# EAGLE design vfd_controller_cpu (EAGLE 9.6.1)
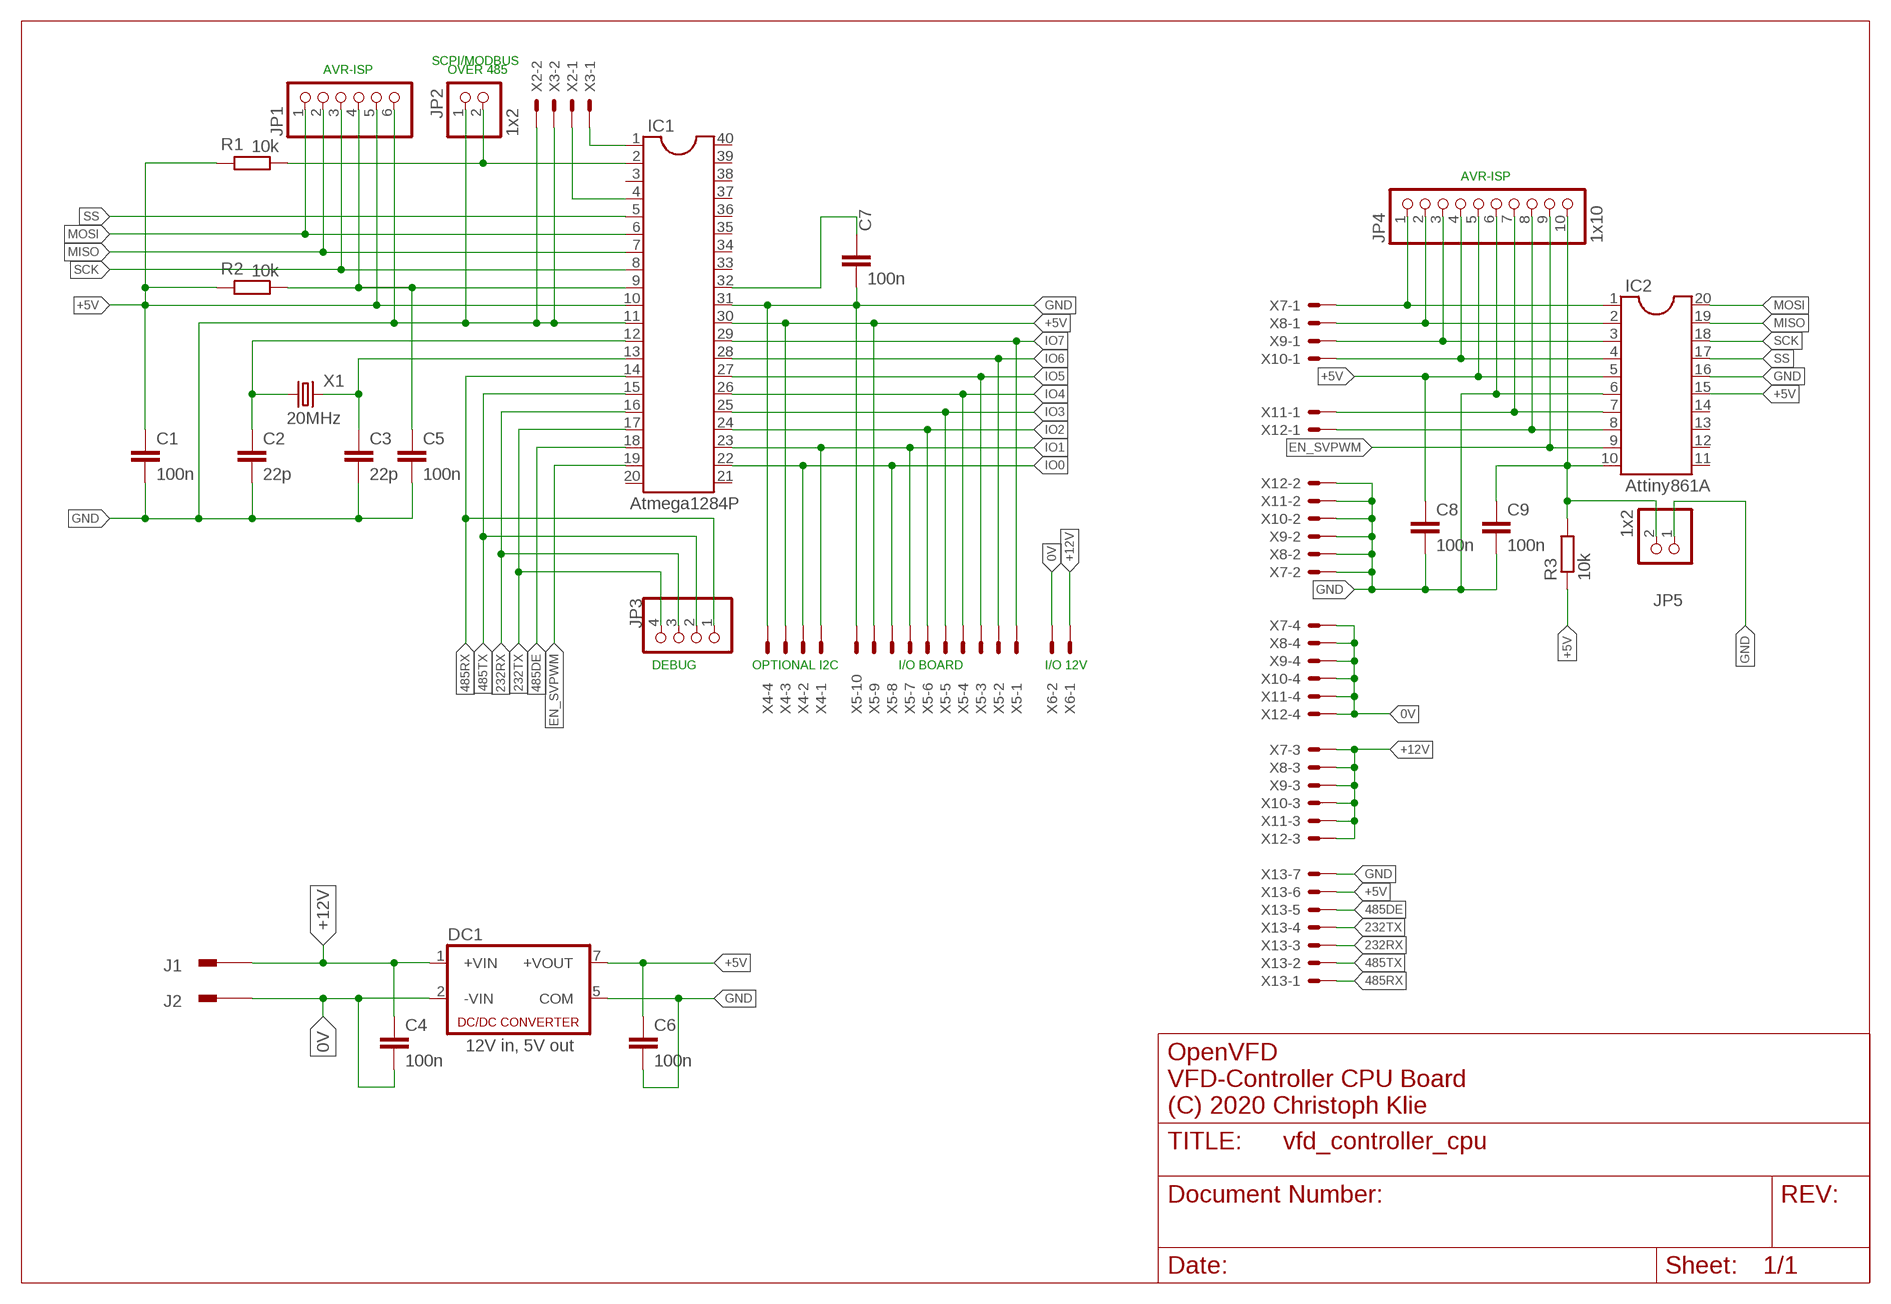
[diagram p0: schematic, sheet 1]

## Parts
C1  100n  C-EU025-024X044  [C025-024X044]
C2  22p  C-EU025-024X044  [C025-024X044]
C3  22p  C-EU025-024X044  [C025-024X044]
C4  100n  C-EU025-024X044  [C025-024X044]
C5  100n  C-EU050-025X075  [C050-025X075]
C6  100n  C-EU050-025X075  [C050-025X075]
C7  100n  C-EU025-024X044  [C025-024X044]
C8  100n  C-EU025-024X044  [C025-024X044]
C9  100n  C-EU025-024X044  [C025-024X044]
DC1  12V in, 5V out  MEV  [MEV]
IC1  Atmega1284P  DIL40  [DIL40]
IC2  Attiny861A  DIL20  [DIL20]
J1  PIN2F061.200  [F061.200]
J2  PIN2F061.200  [F061.200]
JP1  1x6  PINHD-1X6  [1X06]
JP2  1x2  PINHD-1X2  [1X02]
JP3  1x4  PINHD-1X4  [1X04]
JP4  1x10  PINHD-1X10  [1X10]
JP5  1x2  PINHD-1X2  [1X02]
R1  10k  R-EU_0207/12  [0207/12]
R2  10k  R-EU_0204/2V  [0204V]
R3  10k  R-EU_0207/12  [0207/12]
X1  20MHz  CRYSTALS-NOGND-HC49  [HC49]
X2  JST-XH-02-PIN-LONG-PAD  [JST-XH-02-PACKAGE-LONG-PAD]
X3  JST-XH-02-PIN-LONG-PAD  [JST-XH-02-PACKAGE-LONG-PAD]
X4  JST-XH-04-PIN-LONG-PAD  [JST-XH-04-PACKAGE-LONG-PAD]
X5  JST-XH-10-PIN-LONG-PAD  [JST-XH-10-PACKAGE-LONG-PAD]
X6  JST-XH-02-PIN-LONG-PAD  [JST-XH-02-PACKAGE-LONG-PAD]
X7  JST-XH-04-PIN-LONG-PAD  [JST-XH-04-PACKAGE-LONG-PAD]
X8  JST-XH-04-PIN-LONG-PAD  [JST-XH-04-PACKAGE-LONG-PAD]
X9  JST-XH-04-PIN-LONG-PAD  [JST-XH-04-PACKAGE-LONG-PAD]
X10  JST-XH-04-PIN-LONG-PAD  [JST-XH-04-PACKAGE-LONG-PAD]
X11  JST-XH-04-PIN-LONG-PAD  [JST-XH-04-PACKAGE-LONG-PAD]
X12  JST-XH-04-PIN-LONG-PAD  [JST-XH-04-PACKAGE-LONG-PAD]
X13  JST-XH-07-PIN-LONG-PAD  [JST-XH-07-PACKAGE-LONG-PAD]

## Nets
0V: C4.2 DC1.2(-VIN) J2.1A J2.1B X6.2 X7.4 X8.4 X9.4 X10.4 X11.4 X12.4
232RX: IC1.16 JP3.3 X13.3
232TX: IC1.17 JP3.4 X13.4
485DE: IC1.18 X13.5
485RX: IC1.14 JP3.1 X13.1
485TX: IC1.15 JP3.2 X13.2
+5V: C1.1 C6.1 C8.1 DC1.7(+VOUT) IC1.10 IC1.30 IC2.5 IC2.15 JP1.5 JP4.5 R1.2 R2.2 R3.1 X4.3 X5.9 X13.6
+12V: C4.1 DC1.1(+VIN) J1.1A J1.1B X6.1 X7.3 X8.3 X9.3 X10.3 X11.3 X12.3
EN_SVPWM: IC1.19 IC2.9 JP4.9
GND: C1.2 C2.2 C3.2 C5.2 C6.2 C7.2 C8.2 C9.2 DC1.5(COM) IC1.11 IC1.31 IC2.6 IC2.16 JP1.6 JP2.1 JP4.6 JP5.1 X2.2 X3.2 X4.4 X5.10 X7.2 X8.2 X9.2 X10.2 X11.2 X12.2 X13.7
H1: IC2.1 JP4.1 X7.1
H2: IC2.3 JP4.3 X9.1
H3: IC2.7 JP4.7 X11.1
IO0: IC1.22 X4.2 X5.8
IO1: IC1.23 X4.1 X5.7
IO2: IC1.24 X5.6
IO3: IC1.25 X5.5
IO4: IC1.26 X5.4
IO5: IC1.27 X5.3
IO6: IC1.28 X5.2
IO7: IC1.29 X5.1
L1: IC2.2 JP4.2 X8.1
L2: IC2.4 JP4.4 X10.1
L3: IC2.8 JP4.8 X12.1
MISO: IC1.7 IC2.19 JP1.2
MOSI: IC1.6 IC2.20 JP1.1
N$4: IC1.1 X3.1
N$16: C7.1 IC1.32
N$23: IC1.4 X2.1
N$24: IC1.2 JP2.2 R1.1
N$37: C9.1 IC2.10 JP4.10 JP5.2 R3.2
N$41: C5.1 IC1.9 JP1.4 R2.1
N$43: C2.1 IC1.12 X1.1
N$44: C3.1 IC1.13 X1.2
SCK: IC1.8 IC2.18 JP1.3
SS: IC1.5 IC2.17
Unconnected: IC1.3 IC1.20 IC1.21 IC1.33 IC1.34 IC1.35 IC1.36 IC1.37 IC1.38 IC1.39 IC1.40 IC2.11 IC2.12 IC2.13 IC2.14

## Notes on the sheet
- SCPI/MODBUS
- AVR-ISP | OVER 485
- AVR-ISP
- DEBUG | OPTIONAL I2C | I/O BOARD | I/O 12V
- OpenVFD
- VFD-Controller CPU Board
- (C) 2020 Christoph Klie

## Library data of the parts
C1 C4 C7-C9 = rcl:C-EU: CAPACITOR, European symbol; R: MKS02-63 100N; SPICEPREFIX: C
C2 C3 = rcl:C-EU: CAPACITOR, European symbol; R: KERKO 22p; SPICEPREFIX: C
C5 C6 = rcl:C-EU: CAPACITOR, European symbol; R: MKS2-63 100N; SPICEPREFIX: C
DC1 = custom:MEV: DC-DC CONVERTER; R: MEV1S1205SC
IC1 = ic-package:DIL40: Dual In Line; R: ATMEGA 1284-P-PU
IC2 = ic-package:DIL20: Dual In Line / Socket; R: ATTINY 861A-PU
J1 J2 = con-faston:PIN2: Flachstecker Typ Tyco/Electronics/AMP TAB, FASTON Printed Circuit Board Tabs Source: http://www.buerklin.com, http://catalog.tycoelectronics.com; OC_FARNELL: unknown; OC_NEWARK: unknown; R: FS-PW-6,35
JP1 = pinhead:PINHD-1X6: PIN HEADER; R: MPE 087-1-006
JP2 JP5 = pinhead:PINHD-1X2: PIN HEADER; R: MPE 087-1-002
JP3 = pinhead:PINHD-1X4: PIN HEADER; R: MPE 087-1-004
JP4 = pinhead:PINHD-1X10: PIN HEADER; R: MPE 087-1-010
R1-R3 = rcl:R-EU_: RESISTOR, European symbol; R: METALL 10,0K; SPICEPREFIX: R
X1 = IQD-Frequency-Products:CRYSTALS-NOGND: CRYSTALS CAN NOT GROUNDED; R: 20,0000-HC49U-S
X2 X3 X6 =  JST_XH_connnectors:JST-XH-02-PIN: JST XH Connector 2 Pin Wire to board connector. Pitch: 2,54 mm, (0.100") Number of pins: 2 Created by Rembrandt Electronics www.rembrandtelectronics.com; R: JST XH2P ST
X4 X7-X12 =  JST_XH_connnectors:JST-XH-04-PIN: JST XH Connector 2 Pin Wire to board connector. Pitch: 2,54 mm, (0.100") Number of pins: 4 Created by Rembrandt Electronics www.rembrandtelectronics.com; R: JST XH4P ST
X5 =  JST_XH_connnectors:JST-XH-10-PIN: JST XH Connector 2 Pin Wire to board connector. Pitch: 2,54 mm, (0.100") Number of pins: 10 Created by Rembrandt Electronics www.rembrandtelectronics.com; R: JST XH10P ST
X13 =  JST_XH_connnectors:JST-XH-07-PIN: JST XH Connector 2 Pin Wire to board connector. Pitch: 2,54 mm, (0.100") Number of pins: 7 Created by Rembrandt Electronics www.rembrandtelectronics.com; R: JST XH7P ST

## Board
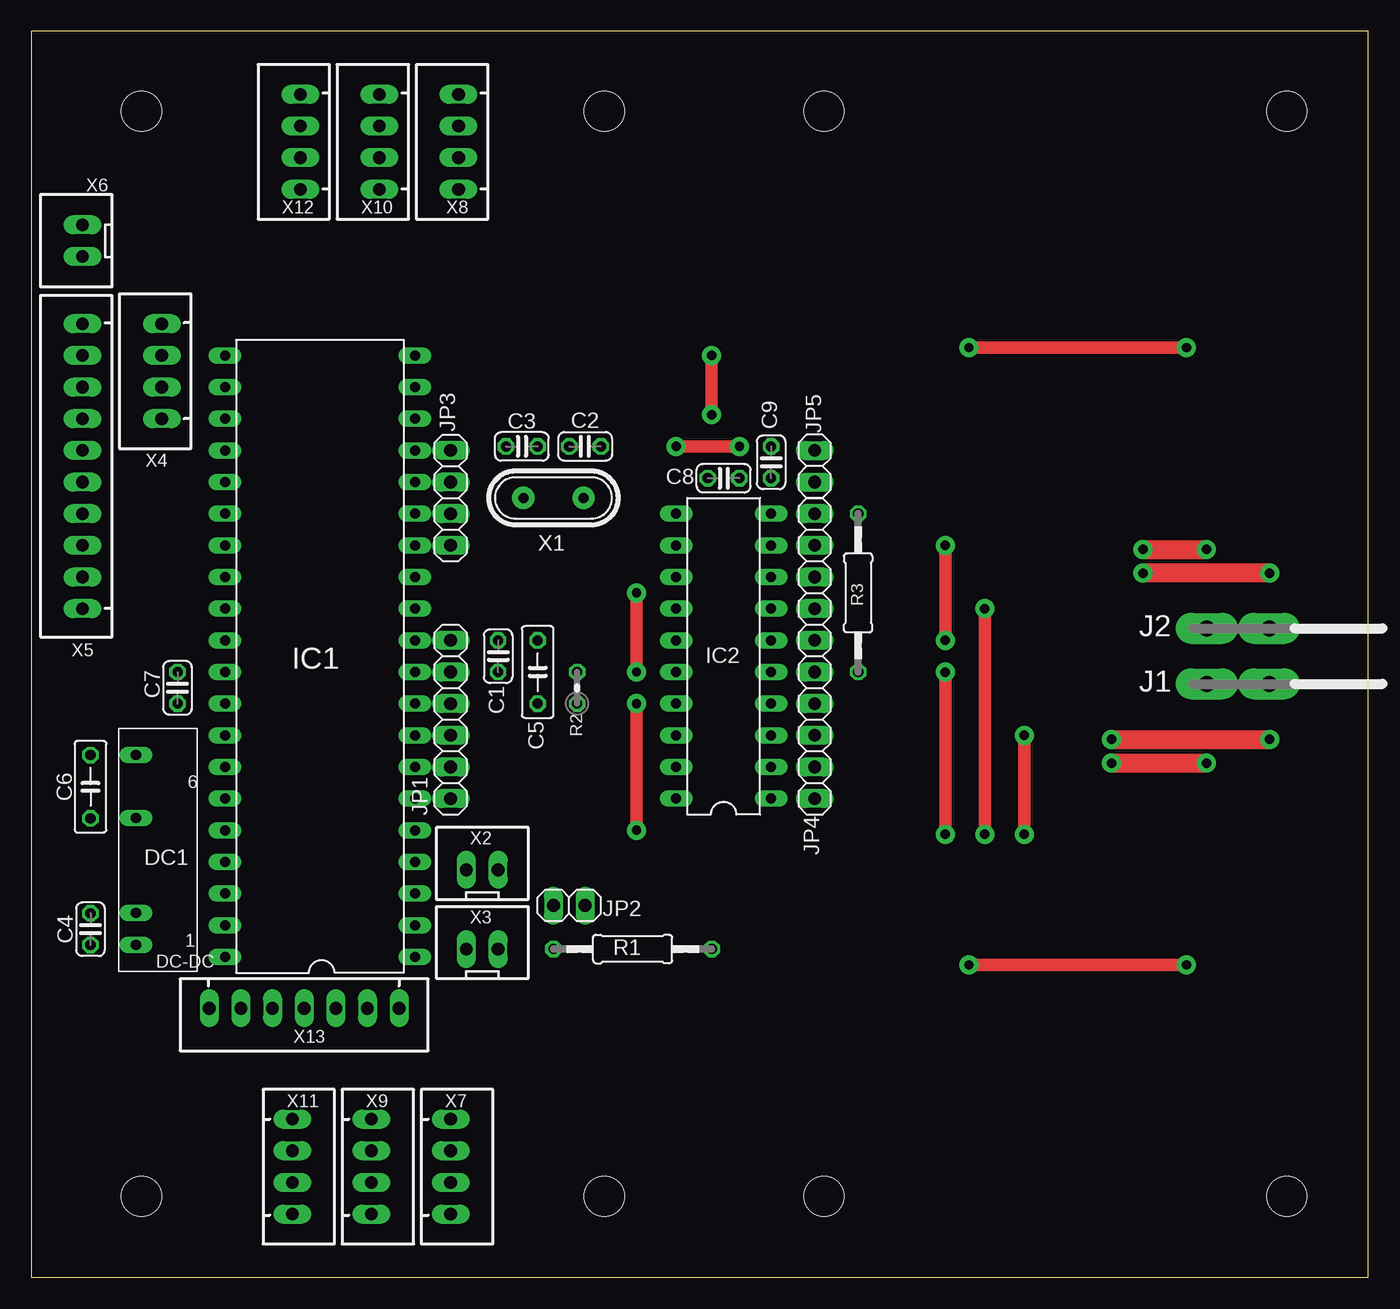
[diagram p1: board, top side]
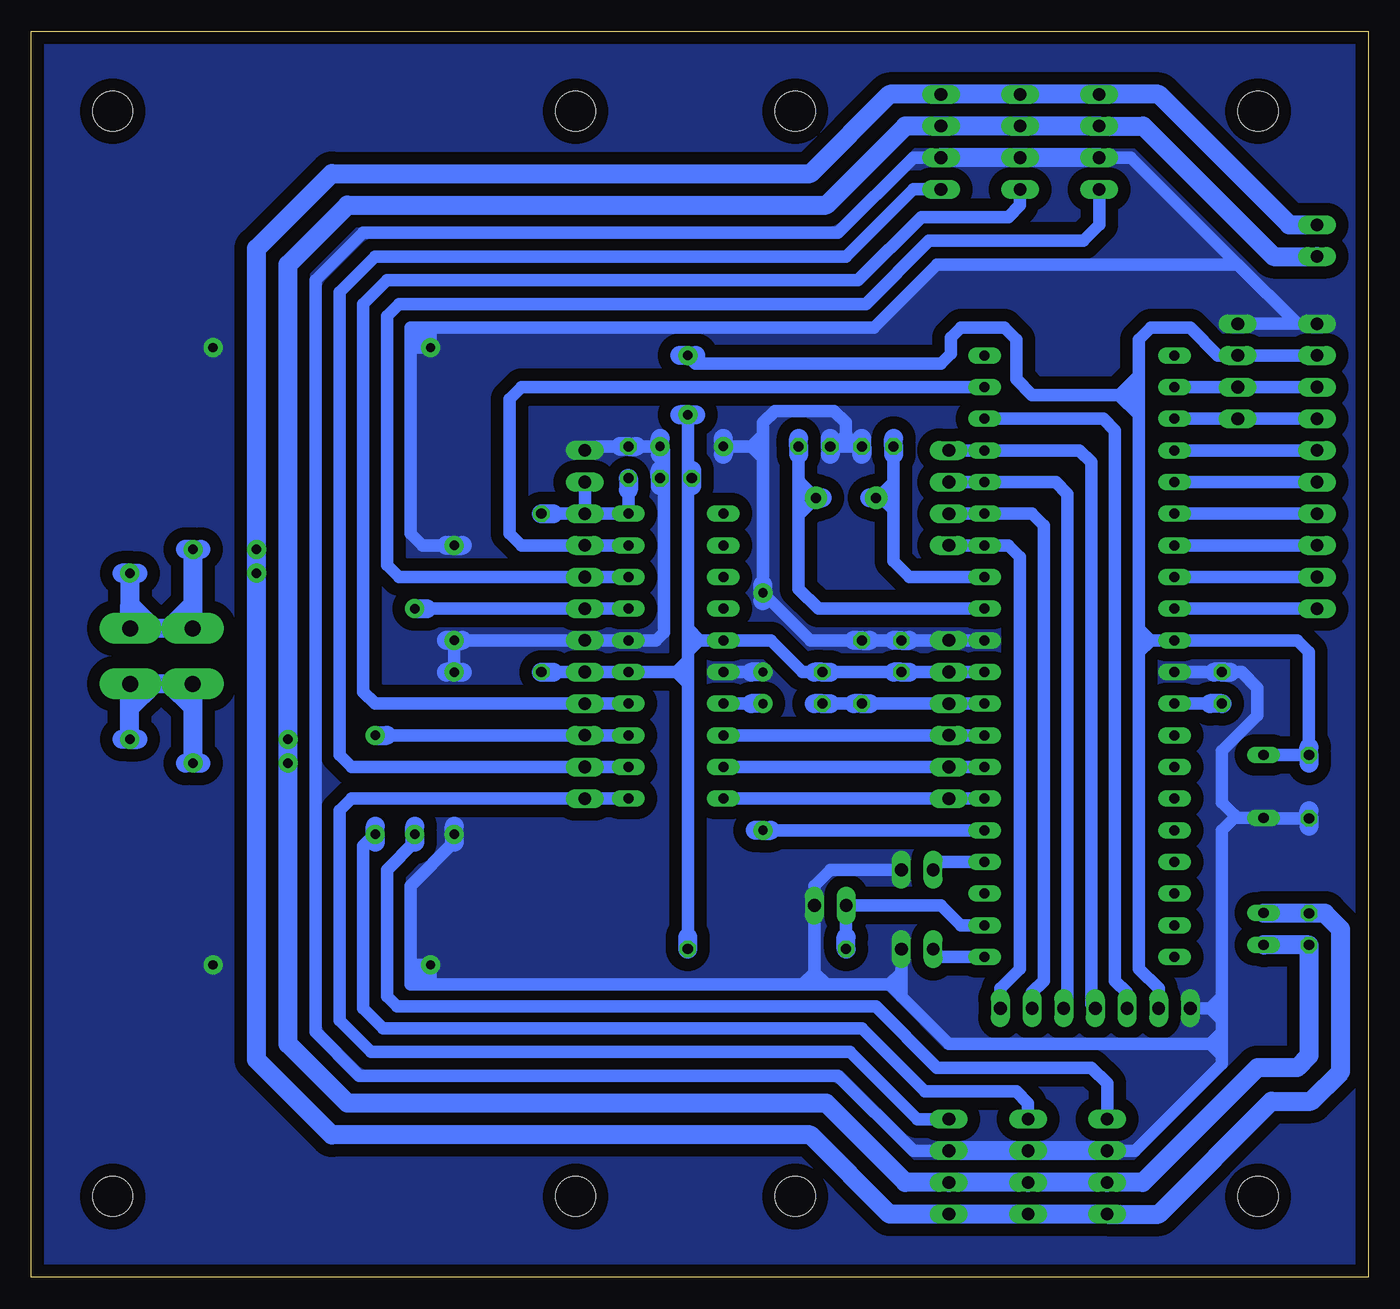
[diagram p2: board, bottom side, seen from below]

Size 107.3 x 100 mm. Coordinates in mm from the lower left corner, seen from the top.
Outline: 0,0 107.3,0 107.3,100 0,100 0,0
Copper layers (1*16): Top 0.035mm / dielectric 1.5mm / Bottom 0.035mm
Design rules "default": minimum track width 6mil, minimum drill 0.35mm, track to track 6mil, track to pad 6mil, pad to pad 6mil, via to via 6mil, smd to smd 6mil, copper to edge 40mil, drill to drill 6mil, minimum pad ring 10mil, minimum via ring 8mil, stop-mask expansion 4mil, vias tented up to drill 0mil, thermal gap 10mil
Holes 3.2 mm at 63.61,93.58 100.76,93.58 63.61,6.5 100.76,6.5 8.85,93.58 45.99,93.58 8.85,6.5 45.99,6.5

### Footprints (pad centres in the part's own frame; a part is rotated, then mirrored left to right if it is on the bottom)
C025-024X044 = drill 0.813 octagon: 1 -1.27,0; 2 1.27,0
C050-025X075 = drill 0.813 octagon: 1 -2.54,0; 2 2.54,0
MEV = drill 0.813 long: 1 -3.683,-6.756; 2 -3.683,-4.216; 5 -3.683,3.404; 7 -3.683,8.484
DIL40 = drill 0.813 long: 1 -24.13,-7.62; 2 -21.59,-7.62; 3 -19.05,-7.62; 4 -16.51,-7.62; 5 -13.97,-7.62; 6 -11.43,-7.62; 7 -8.89,-7.62; 8 -6.35,-7.62; 9 -3.81,-7.62; 10 -1.27,-7.62; 11 1.27,-7.62; 12 3.81,-7.62; 13 6.35,-7.62; 14 8.89,-7.62; 15 11.43,-7.62; 16 13.97,-7.62; 17 16.51,-7.62; 18 19.05,-7.62; 19 21.59,-7.62; 20 24.13,-7.62; 21 24.13,7.62; 22 21.59,7.62; 23 19.05,7.62; 24 16.51,7.62; 25 13.97,7.62; 26 11.43,7.62; 27 8.89,7.62; 28 6.35,7.62; 29 3.81,7.62; 30 1.27,7.62; 31 -1.27,7.62; 32 -3.81,7.62; 33 -6.35,7.62; 34 -8.89,7.62; 35 -11.43,7.62; 36 -13.97,7.62; 37 -16.51,7.62; 38 -19.05,7.62; 39 -21.59,7.62; 40 -24.13,7.62
DIL20 = drill 0.813 long: 1 -11.43,-3.81; 2 -8.89,-3.81; 3 -6.35,-3.81; 4 -3.81,-3.81; 5 -1.27,-3.81; 6 1.27,-3.81; 7 3.81,-3.81; 8 6.35,-3.81; 9 8.89,-3.81; 10 11.43,-3.81; 11 11.43,3.81; 12 8.89,3.81; 13 6.35,3.81; 14 3.81,3.81; 15 1.27,3.81; 16 -1.27,3.81; 17 -3.81,3.81; 18 -6.35,3.81; 19 -8.89,3.81; 20 -11.43,3.81
F061.200 = drill 1.3 pad 2.5 long: 1A -2.5,0; 1B 2.5,0
1X06 = drill 1.016 long: 1 -6.35,0; 2 -3.81,0; 3 -1.27,0; 4 1.27,0; 5 3.81,0; 6 6.35,0
1X02 = drill 1.016 long: 1 -1.27,0; 2 1.27,0
1X04 = drill 1.016 long: 1 -3.81,0; 2 -1.27,0; 3 1.27,0; 4 3.81,0
1X10 = drill 1.016 long: 1 -11.43,0; 2 -8.89,0; 3 -6.35,0; 4 -3.81,0; 5 -1.27,0; 6 1.27,0; 7 3.81,0; 8 6.35,0; 9 8.89,0; 10 11.43,0
0207/12 = drill 0.813 octagon: 1 -6.35,0; 2 6.35,0
0204V = drill 0.813 octagon: 1 -1.27,0; 2 1.27,0
HC49 = drill 0.813 pad 1.8: 1 -2.413,0; 2 2.413,0
JST-XH-02-PACKAGE-LONG-PAD = drill 1.016 long: 1 -1.27,0; 2 1.27,0
JST-XH-04-PACKAGE-LONG-PAD = drill 1.016 long: 1 -3.81,0; 2 -1.27,0; 3 1.27,0; 4 3.81,0
JST-XH-10-PACKAGE-LONG-PAD = drill 1.016 long: 1 -11.43,0; 2 -8.89,0; 3 -6.35,0; 4 -3.81,0; 5 -1.27,0; 6 1.27,0; 7 3.81,0; 8 6.35,0; 9 8.89,0; 10 11.43,0
JST-XH-07-PACKAGE-LONG-PAD = drill 1.016 long: 1 -7.62,0; 2 -5.08,0; 3 -2.54,0; 4 0,0; 5 2.54,0; 6 5.08,0; 7 7.62,0

### Placement (x,y rotation side)
C1  37.46,49.85 90 top
C2  44.45,66.68 180 top
C3  39.37,66.68 0 top
C4  4.76,27.94 90 top
C5  40.64,48.58 90 top
C6  4.76,39.37 270 top
C7  11.75,47.31 90 top
C8  55.56,64.13 0 top
C9  59.37,65.41 90 top
DC1  12.09,33.45 0 top
IC1  23.18,49.85 90 top
IC2  55.56,49.85 90 top
J1  96.84,47.62 0 top
J2  96.84,52.07 0 top
JP1  33.66,44.77 90 top
JP2  43.18,29.85 180 top
JP3  33.66,62.55 90 top
JP4  62.86,49.85 90 top
JP5  62.86,65.09 270 top
R1  48.26,26.35 0 top
R2  43.81,47.31 90 top
R3  66.36,54.93 90 top
U$1  [A4L-LOC]  -78.11,-44.13 0 top  (outside the outline)
X1  41.91,62.55 180 top
X2  36.19,32.7 0 top
X3  36.19,26.35 0 top
X4  10.48,72.71 90 top
X5  4.13,65.09 90 top
X6  4.13,83.19 90 top
X7  33.66,8.89 270 top
X8  34.29,91.12 90 top
X9  27.3,8.89 270 top
X10  27.94,91.12 90 top
X11  20.95,8.89 270 top
X12  21.59,91.12 90 top
X13  21.91,21.59 180 top

### Tracks (layer width: path | path; a pad name or v marks a point on that pad's centre or on a via)
0V  (via drill 0.76 pad 1.52)
  Top 1.524: v89.22,58.42 v94.3,58.42 | v99.38,56.51 v89.22,56.51
  Bottom 1.524: 96.2,52.07 J2.1A 94.34,53.98 | 96.2,52.07 97.47,52.07 | 97.47,52.07 J2.1B 99.38,52.11 99.38,53.98 | DC1.2 8.38,29.21 C4.2 3.49,29.21 2.22,27.94 2.22,16.51 4.6,14.13 7.78,14.13 16.83,5.08 X11.4 X9.4 X7.4 38.42,5.08 44.77,11.43 83.18,11.43 89.22,17.46 v89.22,58.42 89.22,82.55 83.18,88.58 44.77,88.58 38.42,94.93 X8.4 X10.4 X12.4 16.83,94.93 6.35,84.46 X6.2 | v99.38,56.51 99.38,53.98 | v94.3,58.42 94.34,58.38 94.34,53.98 | 94.34,53.98 96.2,52.11 96.2,52.07 | 99.38,53.98 97.47,52.07 | v94.3,58.42 93.66,58.42 | v94.3,58.42 94.93,58.42 | v99.38,56.51 98.74,56.51 | v99.38,56.51 100.01,56.51
232RX
  Bottom 1.016: X13.3 24.13,21.91 24.13,62.87 25.08,63.82 IC1.16 JP3.3
232TX
  Bottom 1.016: X13.4 22.22,21.91 22.22,65.4 23.18,66.36 IC1.17 JP3.4
485DE
  Bottom 1.016: IC1.18 21.27,68.9 20.32,67.95 20.32,23.81 19.37,22.86 X13.5
485RX
  Bottom 1: IC1.14 JP3.1
  Bottom 1.016: IC1.14 28.89,58.74 27.94,57.79 27.94,24.76 29.53,23.18 X13.1
485TX
  Bottom 1.016: X13.2 26.99,22.86 26.03,23.81 26.03,60.32 26.99,61.28 IC1.15 JP3.2
+5V  (via drill 0.76 pad 1.52)
  Top 1.016: v54.61,73.98 v54.61,69.21
  Bottom 1: IC1.10 JP1.5 36.83,48.58 | JP4.5 IC2.5 56.2,48.58 | 54.61,50.16 53.66,51.12 IC2.15 47.94,51.12 45.4,48.58 44.45,48.58 | C1.1 43.18,48.58
  Bottom 1.016: X5.9 X4.3 | X4.3 11.43,73.98 | X4.3 12.06,73.98 14.29,76.2 17.46,76.2 18.41,75.25 18.41,72.39 | C6.1 8.38,41.91 DC1.7 | 17.46,51.12 IC1.30 5.71,51.12 4.76,50.16 4.76,42.54 | 17.46,51.12 18.41,52.07 | 18.41,52.07 18.41,69.21 | 18.41,69.21 18.41,70.8 | 18.41,70.8 18.41,72.39 | 17.46,51.12 18.41,50.16 | 18.41,50.16 18.41,24.76 16.83,23.18 X13.6 | 18.41,52.07 18.41,50.16 | v54.61,73.98 53.98,73.34 34.29,73.34 33.5,74.14 33.5,75.41 32.7,76.2 29.21,76.2 28.26,75.25 28.26,72.07 26.99,70.8 20,70.8 | 54.61,52.07 53.66,51.12 | v54.61,69.21 54.61,64.77 | 54.61,64.77 54.61,63.82 | 54.61,63.82 54.61,52.07 | 54.61,49.53 54.61,50.16 54.61,52.07 | 54.61,49.53 54.61,47.62 | 54.61,47.62 54.61,27.31 | 55.56,48.58 54.61,49.53 | 56.2,48.58 55.56,48.58 | 55.56,48.58 54.61,47.62 | 18.41,69.21 20,70.8 | 20,70.8 18.41,72.39 | 20,70.8 18.41,70.8 | JP4.5 65.4,48.58 | 54.29,64.45 54.61,64.77 | C8.1 54.61,63.82
  Bottom 1.524: 38.1,48.58 C1.1 36.83,48.58 | C8.1 54.29,63.82 | C8.1 54.29,64.45 | C8.1 54.29,64.77 | C8.1 54.29,63.5 | 53.98,69.21 v54.61,69.21 55.24,69.21 | R3.1 65.4,48.58 | R1.2 54.61,27.31 | 43.18,48.58 R2.2 44.45,48.58 | 53.98,73.98 v54.61,73.98 55.24,73.98 | 4.76,41.27 C6.1 4.76,42.54
+12V  (via drill 0.76 pad 1.52)
  Top 1.524: v86.68,41.27 v94.3,41.27 | v86.68,43.18 v99.38,43.18
  Bottom 1.524: 96.2,47.62 J1.1A 94.3,47.59 94.3,45.72 | 96.2,47.62 97.47,47.62 | 97.47,47.62 J1.1B 99.38,47.59 99.38,45.72 | DC1.1 8.38,26.67 C4.1 4.76,17.78 5.71,16.83 8.89,16.83 18.1,7.62 X11.3 X9.3 X7.3 37.15,7.62 43.5,13.97 81.92,13.97 86.68,18.73 v86.68,41.27 86.68,81.28 81.92,86.04 43.5,86.04 37.15,92.39 X8.3 X10.3 X12.3 18.05,92.39 7.62,81.96 7.62,81.91 X6.1 | v99.38,43.18 99.38,45.72 | v94.3,41.27 94.3,45.72 | 94.3,45.72 96.2,47.62 | 99.38,45.72 97.47,47.62 | v94.3,41.27 93.66,41.27 | v94.3,41.27 94.93,41.27 | v99.38,43.18 98.74,43.18 | v99.38,43.18 100.01,43.18
EN_SVPWM
  Bottom 1: IC2.9 JP4.9
  Bottom 1.016: IC1.19 67.95,71.44 68.9,70.49 68.9,59.69 67.95,58.74 JP4.9
GND  (via drill 0.75 pad 1.52, 0.76 pad 1.52)
  Top 1: v48.58,54.93 v48.58,48.58
  Top 1.016: v73.34,58.74 v73.34,51.12 | v73.34,48.58 v73.34,35.56 | v56.83,66.68 v51.75,66.68 | v75.25,74.61 v92.71,74.61 | v75.25,25.08 v92.71,25.08
  Bottom 1: IC1.11 JP1.6 36.83,51.12 | IC2.6 JP4.6 65.72,51.12 | 38.1,51.12 40,51.12 | 41.27,51.12 44.77,51.12 v48.58,54.93 48.58,65.09 48.58,65.72 48.58,67.63 48.58,68.58 47.62,69.53 42.86,69.53 41.91,68.58 41.91,67.63 | 49.53,48.58 IC2.16 | 12.38,48.58 IC1.31 | 41.91,66.68 C3.2 40.96,66.68 41.91,67.63 | 41.91,66.68 C2.2 42.86,66.68 41.91,67.63 | 41.91,67.63 41.91,66.68
  Bottom 1.016: 48.58,64.77 48.58,65.09 48.58,65.4 | X7.2 36.51,10.16 42.55,16.19 80.96,16.19 84.45,19.69 84.45,80.01 80.64,83.82 42.55,83.82 36.51,89.85 X8.2 | X11.2 18.73,10.16 11.75,17.15 11.75,17.78 | 37.46,22.54 33.66,18.73 12.7,18.73 | 37.46,22.54 38.42,23.49 | X5.10 5.71,76.52 | 5.71,76.52 X4.4 | 5.71,76.52 10.48,81.28 | 10.48,81.28 19.05,89.85 X12.2 | 38.42,23.49 43.5,23.49 | 43.5,23.49 45.4,23.49 | 45.4,23.49 75.25,23.49 | 75.25,23.49 76.52,23.49 | 76.52,23.49 76.83,23.49 76.83,25.08 | 75.25,76.2 39.69,76.2 34.61,81.28 10.48,81.28 | 75.25,76.2 76.83,76.2 76.83,74.61 | 76.83,74.61 76.83,59.69 75.88,58.74 v73.34,58.74 | C6.2 8.38,36.83 DC1.5 10.77,36.86 | 10.77,36.86 11.75,35.88 11.75,22.54 | 11.75,22.54 11.75,21.59 | 11.75,21.59 11.75,20.64 | 11.75,20.64 11.75,19.69 | 11.75,19.69 11.75,17.78 | v73.34,51.12 v73.34,48.58 | 76.83,25.08 76.83,31.43 73.34,34.93 | 10.77,36.86 10.77,37.12 11.75,38.1 11.75,42.23 8.89,45.09 8.89,47.31 10.16,48.58 11.11,48.58 11.43,48.58 | 38.42,23.49 37.46,24.45 | 37.46,24.45 37.46,22.54 | X3.2 37.46,24.45 | X13.7 12.7,21.59 | 11.75,21.59 12.7,21.59 | 11.75,22.54 12.7,21.59 | 12.7,21.59 11.75,20.64 | 11.75,19.69 12.7,18.73 | 12.7,18.73 11.75,17.78 | X2.2 43.18,32.7 44.45,31.43 JP2.1 44.45,24.45 | 44.45,24.45 43.5,23.49 | 44.45,24.45 45.4,23.49 | IC2.6 57.15,51.12 56.52,51.75 56.52,63.82 | v51.75,66.68 49.53,66.68 | 49.53,66.68 49.21,66.68 | v75.25,25.08 76.83,25.08 | v75.25,25.08 75.25,23.49 | v75.25,25.08 76.52,23.81 76.52,23.49 | v75.25,74.61 75.25,76.2 | v75.25,74.61 76.83,74.61 | v75.25,74.61 76.2,75.57 | 65.72,51.12 72.71,51.12 | 56.52,64.45 56.52,63.82 | 56.52,63.82 C8.2 56.52,64.45 | 48.58,67.63 49.53,66.68
  Bottom 1.016: 49.53,66.68 48.58,65.72 | 56.52,64.45 56.52,66.36 v56.83,66.68 58.74,66.68 | 60.01,66.68 62.55,66.68 JP5.1
  Bottom 1.524: 11.43,48.58 C7.2 | C7.2 12.38,48.58 | 48.58,55.56 v48.58,54.93 48.58,54.29 | v48.58,48.58 49.53,48.58 | 38.1,51.12 C1.2 36.83,51.12 | X12.2 X10.2 X8.2 | X11.2 X9.2 X7.2 | 40.64,67.31 C3.2 40.64,66.04 | 43.18,67.31 C2.2 43.18,66.04 | 51.75,67.31 v51.75,66.68 51.75,66.04 | C8.2 56.83,64.45 | C8.2 56.83,63.82 | C8.2 56.83,64.77 | C8.2 56.83,63.5 | 56.83,66.04 v56.83,66.68 56.83,67.31 | 58.74,66.68 C9.2 60.01,66.68 | 72.71,48.58 v73.34,48.58 73.98,48.58 | 73.34,36.2 v73.34,35.56 73.34,34.93 | 40,51.12 C5.2 41.27,51.12 | C7.2 11.11,48.58 | 4.76,37.46 C6.2 4.76,36.2 | 73.98,51.12 v73.34,51.12 72.71,51.12 | 72.71,58.74 v73.34,58.74 73.98,58.74
  pour Bottom (isolate 1, no thermals): 0.95,100.01 107.31,100.01 107.31,0 0.95,0
H1
  Bottom 1.016: IC2.1 JP4.1 81.6,38.42 82.55,37.46 82.55,20.64 80.01,18.1 41.59,18.1 36.19,12.7 X7.1
H2  (via drill 0.76 pad 1.52)
  Top 1.016: v79.69,43.5 v79.69,35.56
  Bottom 1.016: IC2.3 JP4.3 78.74,43.5 | X9.1 27.3,13.97 28.26,14.92 35.56,14.92 40.64,20 79.06,20 80.64,21.59 80.64,34.61 v79.69,35.56
  Bottom 1.524: v79.69,43.5 78.74,43.5 | 79.69,36.2 v79.69,35.56 79.69,34.93
H3  (via drill 0.76 pad 1.52)
  Top 1.016: v76.52,53.66 v76.52,35.56
  Bottom 1.016: IC2.7 JP4.7 75.56,53.66 | X11.1 20.95,15.56 22.22,16.83 34.61,16.83 39.53,21.75 77.95,21.75 78.74,22.54 78.74,32.7 76.52,34.93
  Bottom 1.524: v76.52,53.66 75.56,53.66 | 76.52,36.2 v76.52,35.56 76.52,34.93
IO0
  Bottom 1.016: X5.8 X4.2 IC1.22
IO1
  Bottom 1.016: X5.7 X4.1 IC1.23
IO2
  Bottom 1.016: IC1.24 X5.6
IO3
  Bottom 1.016: IC1.25 X5.5
IO4
  Bottom 1.016: IC1.26 X5.4
IO5
  Bottom 1.016: IC1.27 X5.3
IO6
  Bottom 1.016: IC1.28 X5.2
IO7
  Bottom 1.016: IC1.29 X5.1
L1
  Bottom 1.016: IC2.2 JP4.2 81.6,40.96 82.55,41.91 82.55,79.06 79.69,81.91 41.91,81.91 36.51,87.31 X8.1
L2
  Bottom 1.016: IC2.4 JP4.4 79.69,46.04 80.64,46.99 80.64,78.1 78.74,80.01 40.96,80.01 35.88,85.09 28.89,85.09 27.94,86.04 X10.1
L3
  Bottom 1.016: IC2.8 JP4.8 77.79,56.2 78.74,57.15 78.74,77.15 77.79,78.1 40.32,78.1 35.24,83.18 22.86,83.18 21.59,84.46 X12.1
MISO
  Bottom 1: IC1.7 JP1.2 IC2.19
MOSI
  Bottom 1: IC1.6 JP1.1 IC2.20
N$4
  Bottom 1.016: IC1.1 34.29,25.72 X3.1
N$16
  Bottom 1: 12.7,46.04 IC1.32
  Bottom 1.524: C7.1 12.7,46.04
N$23
  Bottom 1.016: X2.1 34.29,33.34 IC1.4
N$24
  Bottom 1.016: IC1.2 32.7,28.26 34.29,29.85 JP2.2 41.91,27.31
  Bottom 1.524: R1.1 41.91,27.31
N$37
  Bottom 1: JP4.10 IC2.10
  Bottom 1.016: JP5.2 JP4.10 65.4,61.28 | 59.37,63.18 IC2.10
  Bottom 1.524: C9.1 59.37,63.18 | R3.2 65.4,61.28
N$41
  Bottom 1: IC1.9 JP1.4 40,46.04 | 41.27,46.04 43.18,46.04
  Bottom 1.524: 43.18,46.04 R2.1 44.45,46.04 | 40,46.04 C5.1 41.27,46.04
N$43
  Bottom 1: IC1.12 44.13,53.66 45.72,55.24 45.72,61.15 | 45.72,61.15 45.72,63.82 | 45.72,66.04 45.72,63.82 | 45.72,63.82 45.59,63.82 X1.1 45.72,61.15
  Bottom 1.524: 45.72,67.31 C2.1 45.72,66.04 | X1.1 43.81,62.55
N$44
  Bottom 1: IC1.13 36.83,56.2 38.1,57.47 38.1,61.6 | 38.1,61.6 38.1,63.82 | 38.1,66.04 38.1,63.82 | X1.2 39.37,62.55 38.1,63.82 | 39.05,62.55 38.1,61.6
  Bottom 1.524: 38.1,67.31 C3.1 38.1,66.04 | 40,62.55 X1.2 39.05,62.55
SCK
  Bottom 1: IC1.8 JP1.3 IC2.18
SS  (via drill 0.75 pad 1.52)
  Top 1: v48.58,35.88 v48.58,46.04
  Bottom 1: 49.53,46.04 IC2.17 | 47.94,35.88 IC1.5
  Bottom 1.524: v48.58,46.04 49.53,46.04 | 49.21,35.88 v48.58,35.88 47.94,35.88
(copper drawn outside any net)
  shapes: Bottom circle x8

### Text on the board
Document: OpenVFD | VFD-Conroller CPU Board | (C) 2020 Christoph Klie | Version 1.0 | [1/1]